# Altium project ESC.PrjPCB
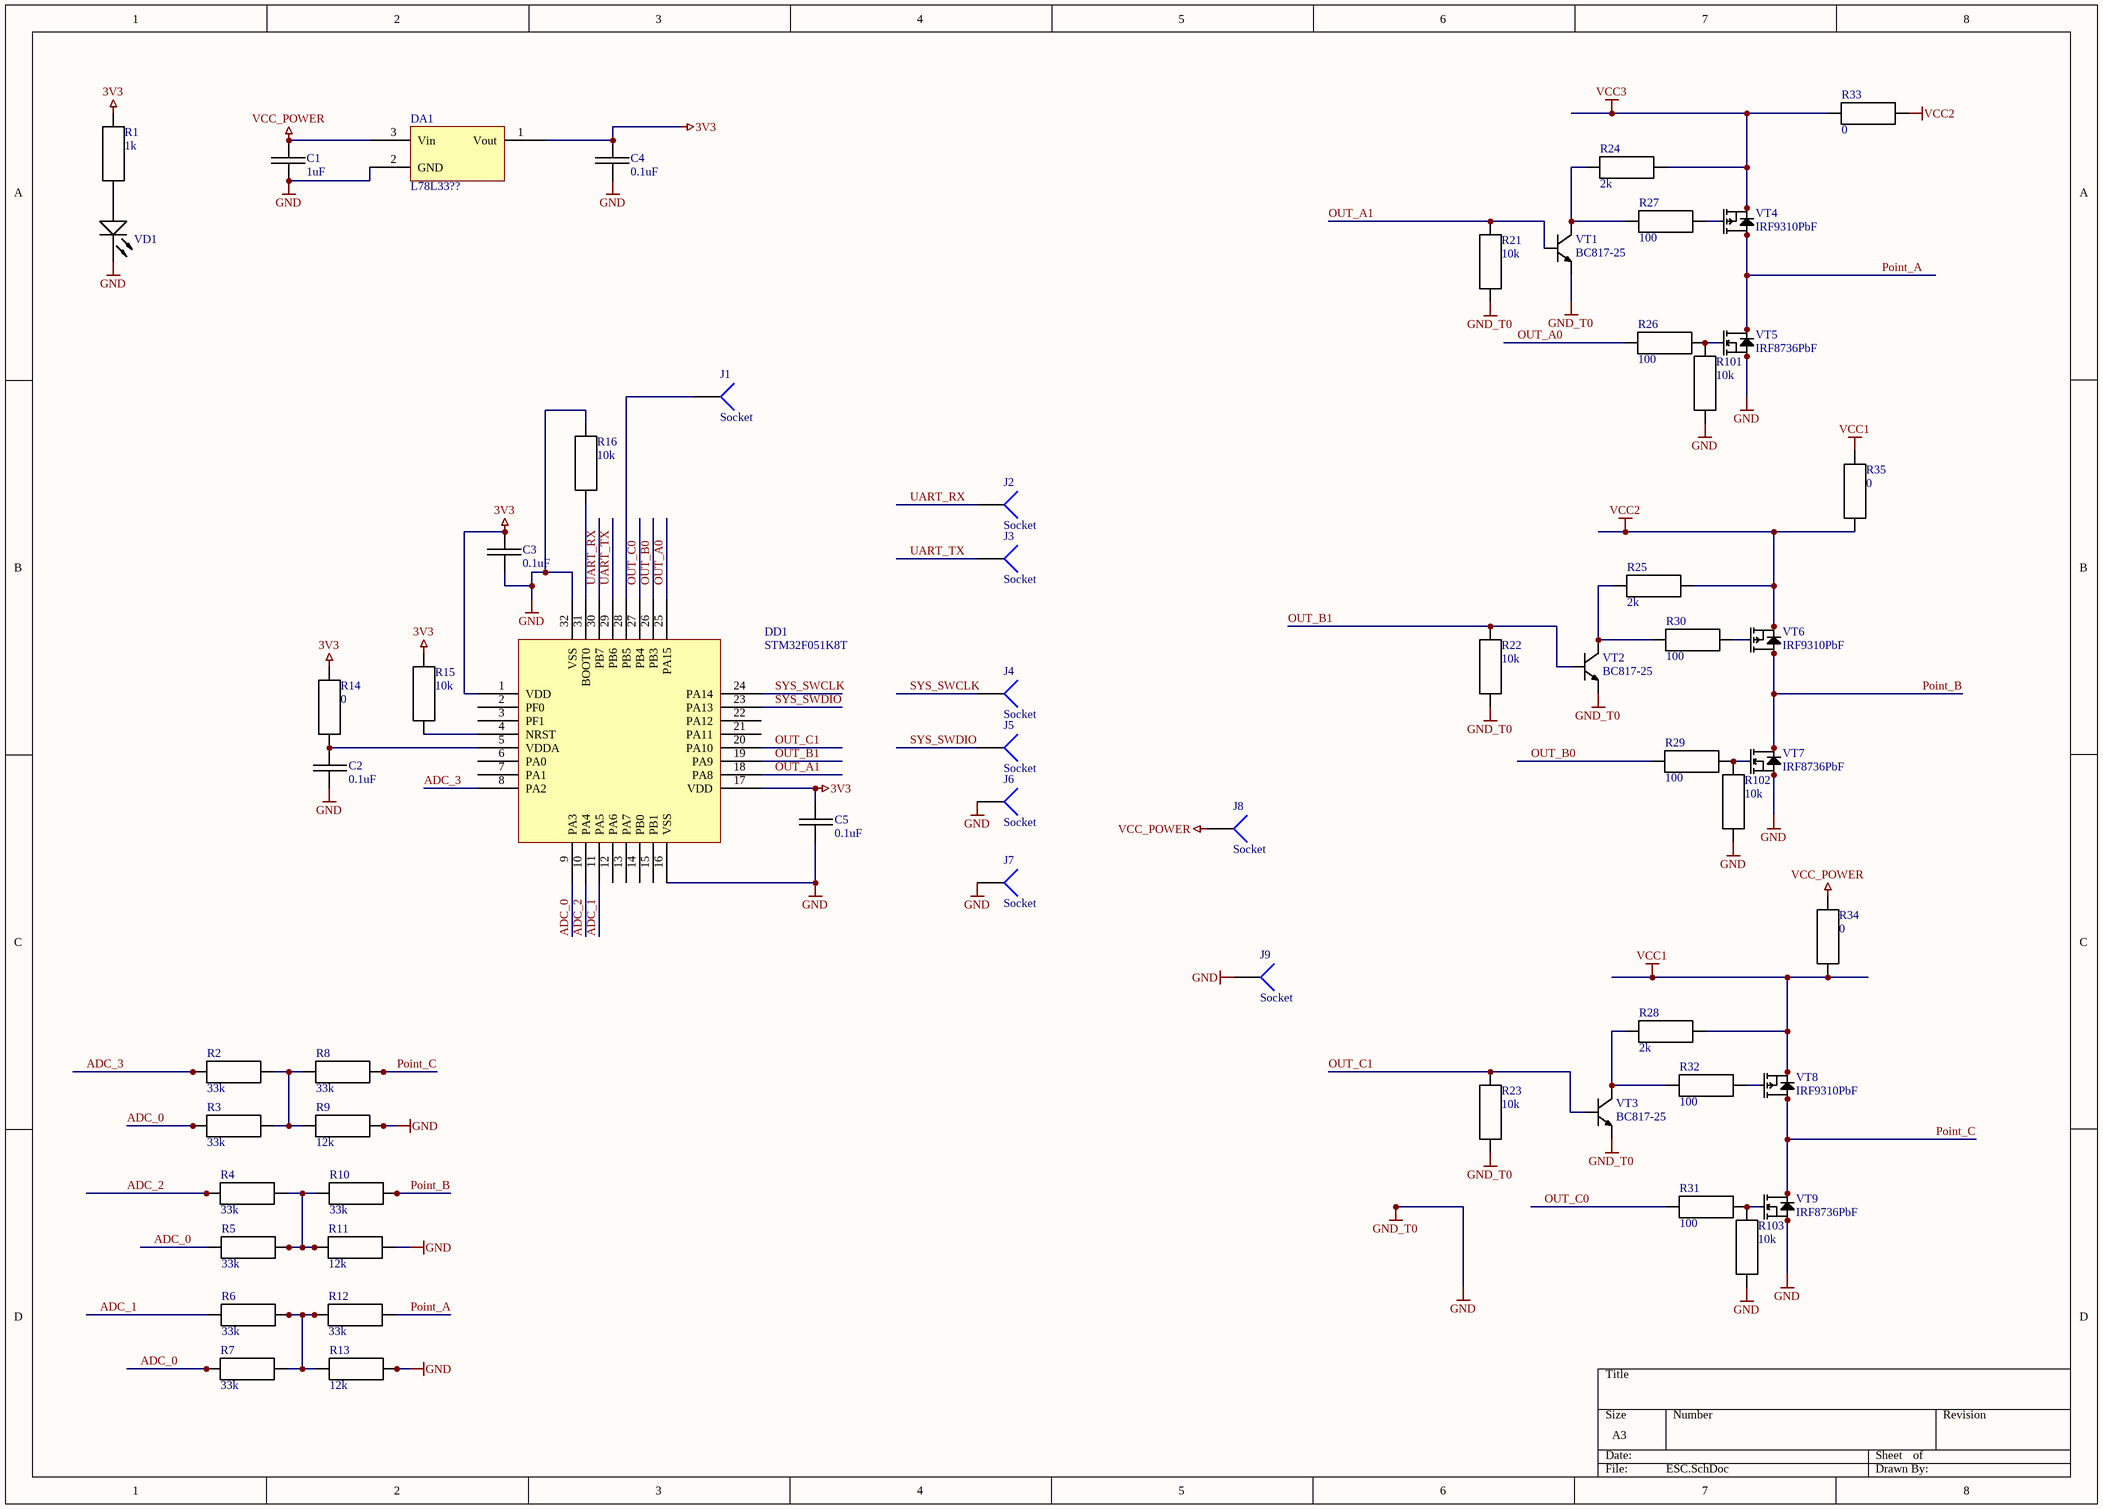
[diagram p0: ESC.SchDoc]
1 sheet, 60 parts. Net scope: global (net labels, ports and power ports of the same name join across sheets).
Board file: ESCv5.PcbDoc

## Sheet ESC.SchDoc
size A3

### Parts
C1  1uF  [CAP0805]
C2  0.1uF  [CAP0603]
C3  0.1uF  [CAP0603]
C4  0.1uF  [CAP0603]
C5  0.1uF  [CAP0603]
DA1  L78L33??  [SOT89]
DD1  STM32F051K8T  [LQFP32-STM32]
J1  Socket  [PIN1]
J2  Socket  [PIN1]
J3  Socket  [PIN1]
J4  Socket  [PIN1]
J5  Socket  [PIN1]
J6  Socket  [PIN1]
J7  Socket  [PIN1]
J8  Socket  [PIN1]
J9  Socket  [PIN1]
R1  1k  [RES0603]
R2  33k  [RES0805]
R3  33k  [RES0805]
R4  33k  [RES0805]
R5  33k  [RES0805]
R6  33k  [RES0805]
R7  33k  [RES0805]
R8  33k  [RES0805]
R9  12k  [RES0805]
R10  33k  [RES0805]
R11  12k  [RES0805]
R12  33k  [RES0805]
R13  12k  [RES0805]
R14  0  [RES0603]
R15  10k  [RES0603]
R16  10k  [RES0603]
R21  10k  [RES0603]
R22  10k  [RES0603]
R23  10k  [RES0603]
R24  2k  [RES0603]
R25  2k  [RES0603]
R26  100  [RES0805]
R27  100  [RES0603]
R28  2k  [RES0603]
R29  100  [RES0805]
R30  100  [RES0603]
R31  100  [RES0805]
R32  100  [RES0603]
R33  0  [RES1206]
R34  0  [RES2512]
R35  0  [RES1206]
R101  10k  [RES0603]
R102  10k  [RES0603]
R103  10k  [RES0603]
VD1  KP-1608SURC  [Diode 1608]  (value not drawn)
VT1  BC817-25  [SOT23]
VT2  BC817-25  [SOT23]
VT3  BC817-25  [SOT23]
VT4  IRF9310PbF  [SO-8 IRF...]
VT5  IRF8736PbF  [SO-8 IRF...]
VT6  IRF9310PbF  [SO-8 IRF...]
VT7  IRF8736PbF  [SO-8 IRF...]
VT8  IRF9310PbF  [SO-8 IRF...]
VT9  IRF8736PbF  [SO-8 IRF...]

### Nets
3V3: C3.1 C4.1 C5.2 DA1.1(Vout) DD1.1(VDD) DD1.17(VDD) R1.1 R14.2 R15.2
GND: C1.2 C2.1 C3.2 C4.2 C5.1 DA1.2(GND) DD1.16(VSS) DD1.32(VSS) J6.1 J7.1 J9.1 R9.1 R11.1 R13.1 R16.2 R21.2 R22.2 R23.2 R101.2 R102.2 R103.2 VD1.1 VT1.2 VT2.2 VT3.2 VT5.1(S) VT5.2(S) VT5.3(S) VT7.1(S) VT7.2(S) VT7.3(S) VT9.1(S) VT9.2(S) VT9.3(S)  [also labelled GND_T0]
VCC1: R28.1 R34.1 R35.1 VT8.1(S) VT8.2(S) VT8.3(S)
VCC2: R25.1 R33.2 R35.2 VT6.1(S) VT6.2(S) VT6.3(S)
VCC3: R24.1 R33.1 VT4.1(S) VT4.2(S) VT4.3(S)
VCC_POWER: C1.1 DA1.3(Vin) J8.1 R34.2
ADC_0: DD1.9(PA3) R3.2 R5.2 R7.2
ADC_1: DD1.11(PA5) R6.2
ADC_2: DD1.10(PA4) R4.2
ADC_3: DD1.8(PA2) R2.2
OUT_A0: DD1.25(PA15) R26.1
OUT_A1: DD1.18(PA8) R21.1 VT1.1
OUT_B0: DD1.26(PB3) R29.1
OUT_B1: DD1.19(PA9) R22.1 VT2.1
OUT_C0: DD1.27(PB4) R31.1
OUT_C1: DD1.20(PA10) R23.1 VT3.1
Point_A: R12.1 VT4.5(D) VT4.6(D) VT4.7(D) VT4.8(D) VT5.5(D) VT5.6(D) VT5.7(D) VT5.8(D)
Point_B: R10.1 VT6.5(D) VT6.6(D) VT6.7(D) VT6.8(D) VT7.5(D) VT7.6(D) VT7.7(D) VT7.8(D)
Point_C: R8.1 VT8.5(D) VT8.6(D) VT8.7(D) VT8.8(D) VT9.5(D) VT9.6(D) VT9.7(D) VT9.8(D)
SYS_SWCLK: DD1.24(PA14) J4.1
SYS_SWDIO: DD1.23(PA13) J5.1
UART_RX: DD1.30(PB7) J2.1
UART_TX: DD1.29(PB6) J3.1
NetC2_2: C2.2 DD1.5(VDDA) R14.1
NetDD1_4: DD1.4(NRST) R15.1
NetDD1_28: DD1.28(PB5) J1.1
NetDD1_31: DD1.31(BOOT0) R16.1
NetR1_2: R1.2 VD1.2
NetR2_1: R2.1 R3.1 R8.2 R9.2
NetR4_1: R4.1 R5.1 R10.2 R11.2
NetR6_1: R6.1 R7.1 R12.2 R13.2
NetR24_2: R24.2 R27.1 VT1.3
NetR25_2: R25.2 R30.1 VT2.3
NetR26_2: R26.2 R101.1 VT5.4(G)
NetR27_2: R27.2 VT4.4(G)
NetR28_2: R28.2 R32.1 VT3.3
NetR29_2: R29.2 R102.1 VT7.4(G)
NetR30_2: R30.2 VT6.4(G)
NetR31_2: R31.2 R103.1 VT9.4(G)
NetR32_2: R32.2 VT8.4(G)

Not connected (* = marked no-connect by the designer): DD1 2(PF0) 3(PF1) 6(PA0) 7(PA1) 12(PA6) 13(PA7) 14(PB0) 15(PB1) 21(PA11) 22(PA12)

### Library data of the parts
C1-C5 = Capacitor: Voltage: 50V; dielectric: X7R
  C1: Value: 1uF
  C2-C5: Value: 0.1uF
DA1 = DA-L78L05: LDO; Iout: 0.1A; Vin max: 40 V; Vout: 3.3V
DD1 = STM32F051K8T: LQFP32
R1-R16 R21-R35 R101-R103 = Resistor: Toleance: 1%
  R1: Value: 1k
  R2-R8 R10 R12: Value: 33k
  R9 R11 R13: Value: 12k
  R14 R33-R35: Value: 0
  R15 R16 R21-R23 R101-R103: Value: 10k
  R24 R25 R28: Value: 2k
  R26 R27 R29-R32: Value: 100
VD1 = LED_0603: Imax: 30mA; Inorm: 20mA
VT1-VT3 = VT - BC817: NPN; Ukbo max: 50; Ukeo max: 45; Ic: 0.8A; fgr: 100MHz; P max: 0.31W
VT4 VT6 VT8 = IRF9310PbF: P-MOSFET -20A; Vds: -30V; Vgs: +-20V; Pd: 2.5W; Vgs(th): -1.3...-1.8...-2.4; Qg: 58nC; Rds(on): 0.0039...0.0046; Id: -20A
VT5 VT7 VT9 = IRF8736PbF: N-MOSFET 18A; Vds: 30V; Pd: 2.5W; Rds(on): 0.0039-0.006.8; Vgs(th): 1.35...1.8...2.35V; Qg: 17...26nC; Id: 18A
J1-J9 = Socket: LatestRevisionDate: 17-Jul-2002; LatestRevisionNote: Re-released for DXP Platform.; Publisher: Altium Limited